# Altium schematic sheet raijel_sim_v1.SchDoc
size A2
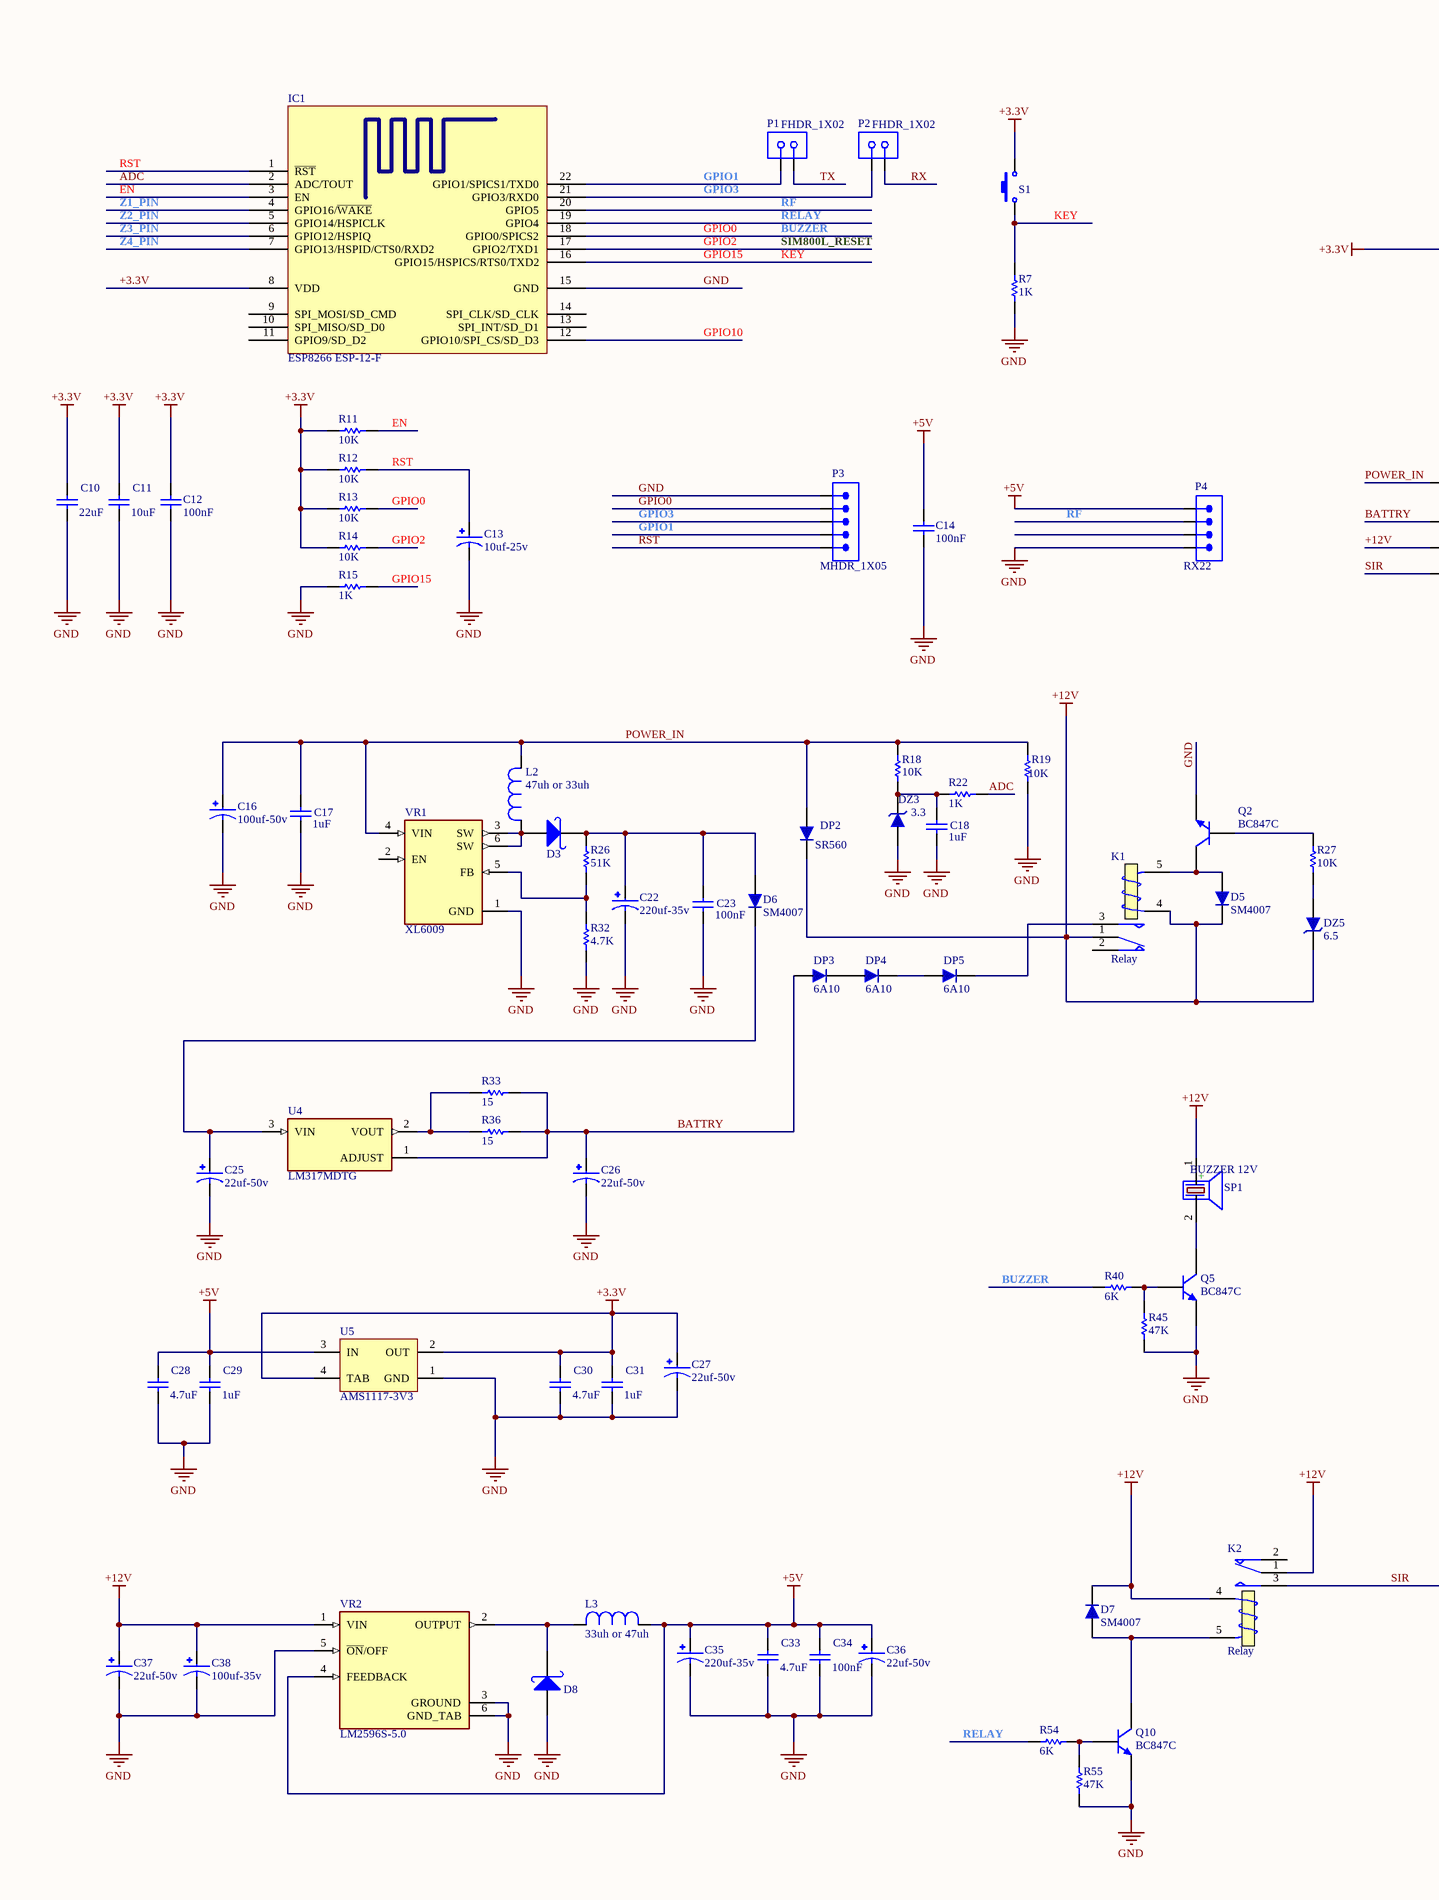
[diagram p0: raijel_sim_v1.SchDoc, left]
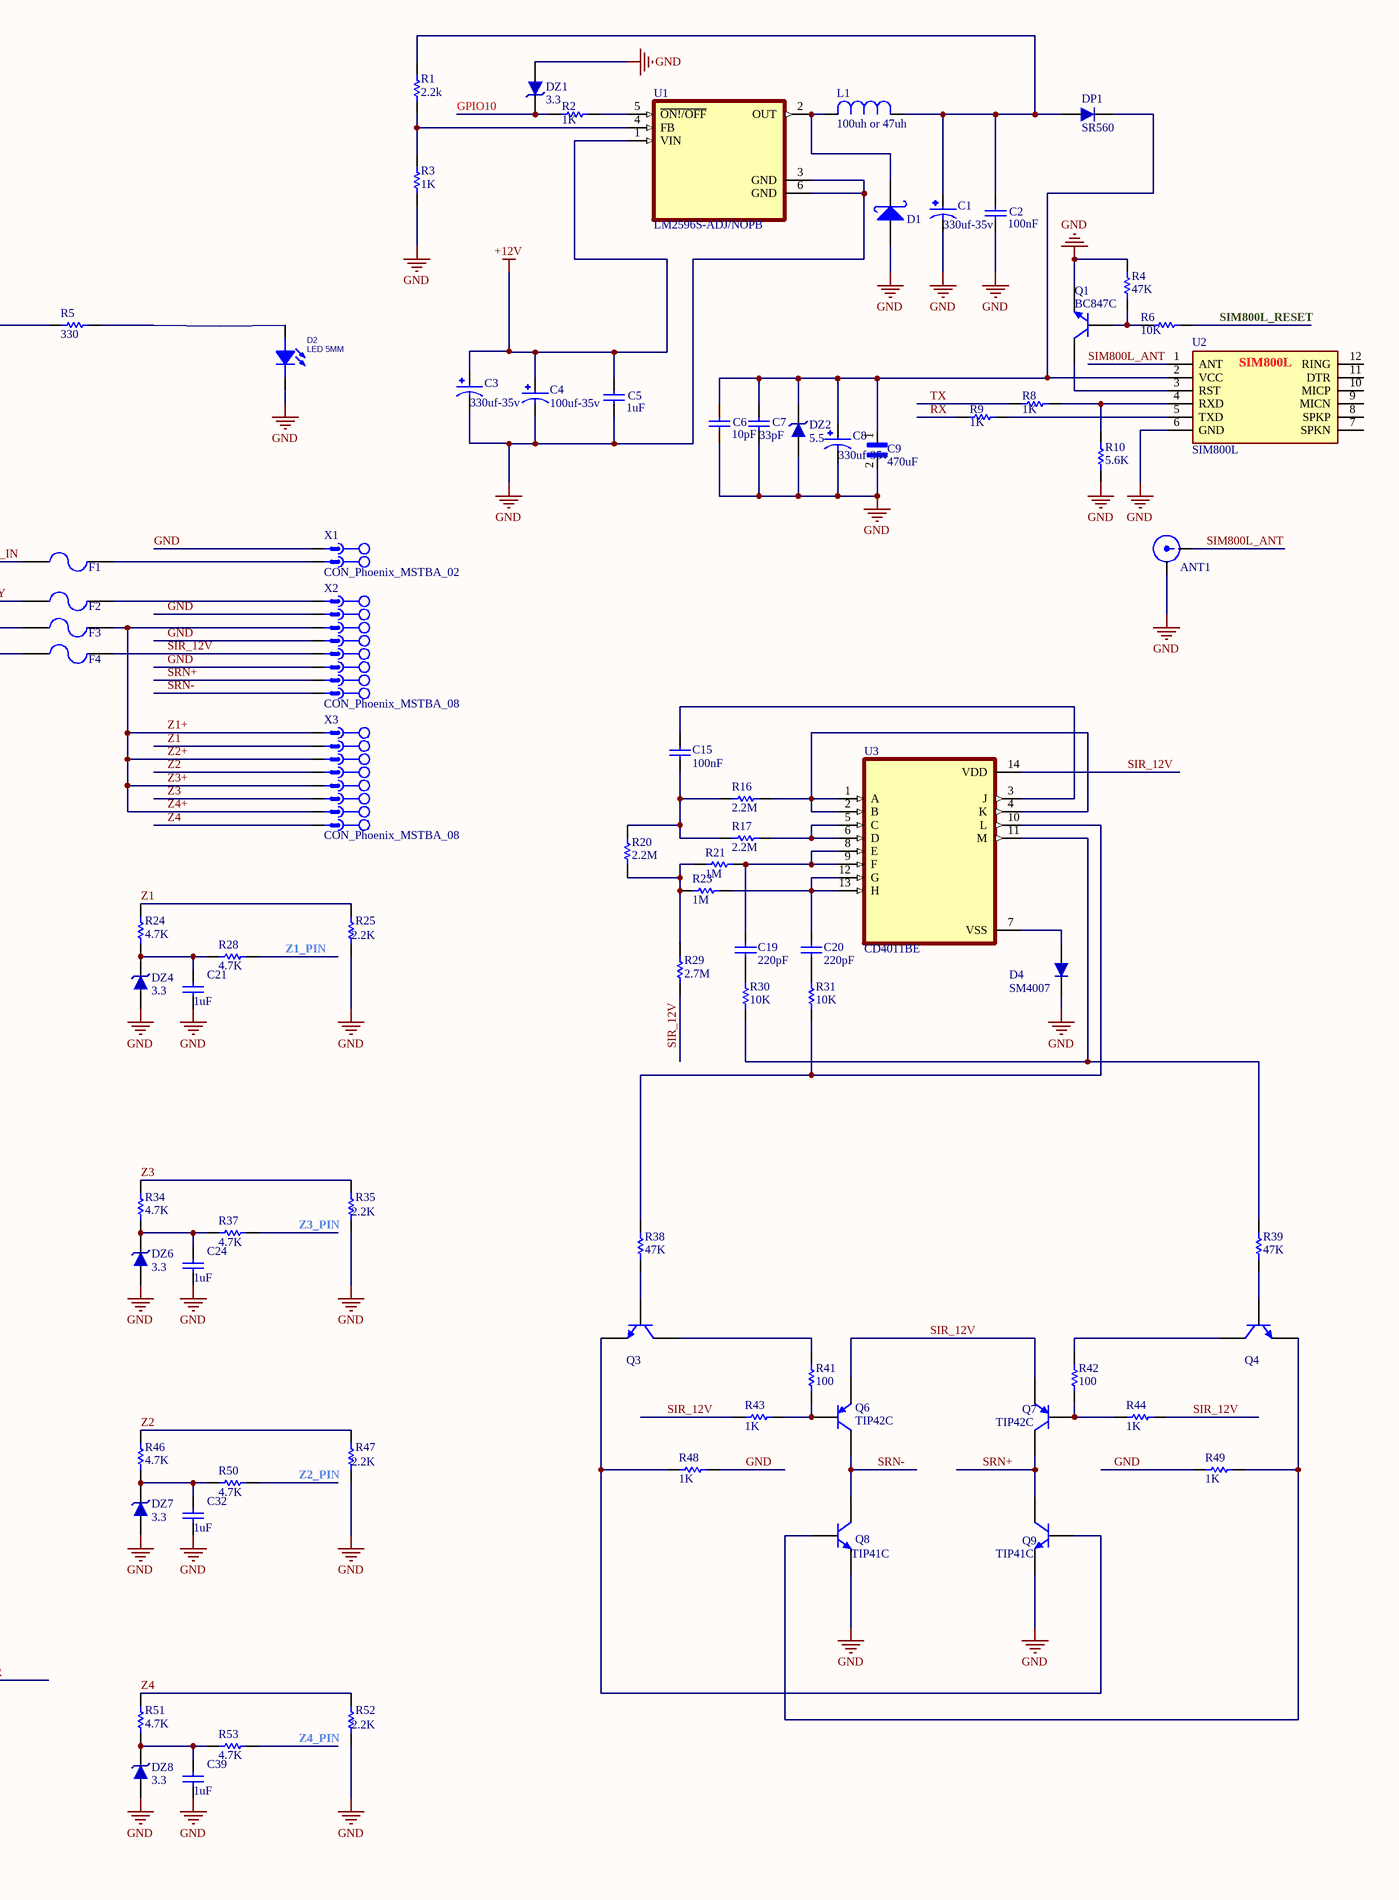
[diagram p1: raijel_sim_v1.SchDoc, right]

## Parts
ANT1  Antenna  [SMA]  (value not drawn)
C1  330uf-35v  [CAP_EEEFP1V221AV]
C2  100nF  [CAP0805]
C3  330uf-35v  [CAP_EEEFP1V221AV]
C4  100uf-35v  [CAP_EEEFP1V221AV]
C5  1uF  [CAP0805]
C6  10pF  [CAP0805]
C7  33pF  [CAP0805]
C8  330uf-35v  [CAP_EEEFP1V221AV]
C9  470uF  [CAPPM7343X310N]
C10  22uF  [CAP0805]
C11  10uF  [CAP0805]
C12  100nF  [CAP0805]
C13  10uf-25v  [CAP_EEEFN1H220UR]
C14  100nF  [CAP0805]
C15  100nF  [CAP Ceramic 5mm]
C16  100uf-50v  [CAP_EEEFN1H101L]
C17  1uF  [CAP0805]
C18  1uF  [CAP0805]
C19  220pF  [CAP Ceramic 5mm]
C20  220pF  [CAP Ceramic 5mm]
C21  1uF  [CAP0805]
C22  220uf-35v  [CAP_EEEFP1V221AV]
C23  100nF  [CAP0805]
C24  1uF  [CAP0805]
C25  22uf-50v  [CAP_EEEFN1H220UR]
C26  22uf-50v  [CAP_EEEFN1H220UR]
C27  22uf-50v  [CAP_EEEFN1H220UR]
C28  4.7uF  [CAP0805]
C29  1uF  [CAP0805]
C30  4.7uF  [CAP0805]
C31  1uF  [CAP0805]
C32  1uF  [CAP0805]
C33  4.7uF  [CAP0805]
C34  100nF  [CAP0805]
C35  220uf-35v  [CAP_EEEFP1V221AV]
C36  22uf-50v  [CAP_EEEFN1H220UR]
C37  22uf-50v  [CAP_EEEFN1H220UR]
C38  100uf-35v  [CAP_EEEFP1V221AV]
C39  1uF  [CAP0805]
D1  1n5822  [DO-214AB(SMC)]  (value not drawn)
D2  LED 5MM  [LED5MM_GRN]
D3  1n5822  [DO-214AB(SMC)]  (value not drawn)
D4  SM4007  [DIODE SMD]
D5  SM4007  [DIODE SMD]
D6  SM4007  [DIODE SMD]
D7  SM4007  [DIODE SMD]
D8  1n5822  [DO-214AB(SMC)]  (value not drawn)
DP1  SR560  [DO-201AD - vertical]
DP2  SR560  [DO-201AD - vertical]
DP3  6A10  [DO-201AD - vertical]
DP4  6A10  [DO-201AD - vertical]
DP5  6A10  [DO-201AD - vertical]
DZ1  3.3  [SOD80, LL-34]
DZ2  5.5  [SOD80, LL-34]
DZ3  3.3  [SOD80, LL-34]
DZ4  3.3  [SOD80, LL-34]
DZ5  6.5  [SOD80, LL-34]
DZ6  3.3  [SOD80, LL-34]
DZ7  3.3  [SOD80, LL-34]
DZ8  3.3  [SOD80, LL-34]
F1  F=1.0 A  [Fuse 5x20 With holder pin]  (value not drawn)
F2  F=1.0 A  [Fuse 5x20 With holder pin]  (value not drawn)
F3  F=1.0 A  [Fuse 5x20 With holder pin]  (value not drawn)
F4  F=1.0 A  [Fuse 5x20 With holder pin]  (value not drawn)
IC1  ESP8266 ESP-12-F  [ESP8266-12E]
K1  Relay  [Relay 15.40x12.10x13.10]
K2  Relay  [Relay 15.40x12.10x13.10]
L1  100uh or 47uh  [IND_CDRH127/LDNP-470MC_SUM]
L2  47uh or 33uh  [IND_CDRH127/LDNP-470MC_SUM]
L3  33uh or 47uh  [IND_CDRH127/LDNP-470MC_SUM]
P1  FHDR_1X02  [FHDR1X02-254P]
P2  FHDR_1X02  [FHDR1X02-254P]
P3  MHDR_1X05  [MHDR1X05-254P]
P4  RX22  [MHDR1X04-254P]
Q1  BC847C  [SOT23_N]
Q2  BC847C  [SOT23_N]
Q3  BC547  [TO-92 BENT]  (value not drawn)
Q4  BC547  [TO-92 BENT]  (value not drawn)
Q5  BC847C  [SOT23_N]
Q6  TIP42C  [TO-220 AB]
Q7  TIP42C  [TO-220 AB]
Q8  TIP41C  [TO-220 AB]
Q9  TIP41C  [TO-220 AB]
Q10  BC847C  [SOT23_N]
R1  2.2k  [RES0805]
R2  1K  [RES0805]
R3  1K  [RES0805_(2012X06L)]
R4  47K  [RES0805]
R5  330  [RES0805]
R6  10K  [RES0805]
R7  1K  [RES0805]
R8  1K  [RES0805]
R9  1K  [RES0805]
R10  5.6K  [RES0805]
R11  10K  [RES0805]
R12  10K  [RES0805]
R13  10K  [RES0805]
R14  10K  [RES0805]
R15  1K  [RES0805]
R16  2.2M  [RES0805]
R17  2.2M  [RES0805]
R18  10K  [RES0805]
R19  10K  [RES0805]
R20  2.2M  [RES0805]
R21  1M  [RES0805]
R22  1K  [RES0805]
R23  1M  [RES0805]
R24  4.7K  [RES1206]
R25  2.2K  [RES1206]
R26  51K  [RES0805_(2012X06L)]
R27  10K  [RES0805]
R28  4.7K  [RES0805]
R29  2.7M  [RES0805]
R30  10K  [RES0805]
R31  10K  [RES0805]
R32  4.7K  [RES0805_(2012X06L)]
R33  15  [Axial 0_5W 5_0mm]
R34  4.7K  [RES1206]
R35  2.2K  [RES1206]
R36  15  [Axial 0_5W 5_0mm]
R37  4.7K  [RES0805]
R38  47K  [RES0805]
R39  47K  [RES0805]
R40  6K  [RES0805]
R41  100  [Axial 0_5W 5_0mm]
R42  100  [Axial 0_5W 5_0mm]
R43  1K  [RES0805]
R44  1K  [RES0805]
R45  47K  [RES0805]
R46  4.7K  [RES1206]
R47  2.2K  [RES1206]
R48  1K  [RES0805]
R49  1K  [RES0805]
R50  4.7K  [RES0805]
R51  4.7K  [RES1206]
R52  2.2K  [RES1206]
R53  4.7K  [RES0805]
R54  6K  [RES0805]
R55  47K  [RES0805]
S1  Switch PB  [Switch - Push to On]  (value not drawn)
SP1  BUZZER 12V  [BUZZER 7.62mm DC]
U1  LM2596S-ADJ/NOPB  [VREG_LM2596S-ADJ/NOPB]
U2  SIM800L  [SIM800L]
U3  CD4011BE  [DIP794W45P254L1969H508Q14]
U4  LM317MDTG  [VREG_LM317MDTG]
U5  AMS1117-3V3  [SOT223]
VR1  XL6009  [DPAK170P1435X465-6N]
VR2  LM2596S-5.0  [TO170P1524X483-6N]
X1  CON_Phoenix_MSTBA_02  [CON_MSTBA02]
X2  CON_Phoenix_MSTBA_08  [CON_MSTBA08]
X3  CON_Phoenix_MSTBA_08  [CON_MSTBA08]

## Nets
+3.3V: C10.2 C11.2 C12.2 C27.1 C30.2 C31.2 IC1.8(VDD) R5.1 R11.2 R12.2 R13.2 R14.2 S1.2 U5.2(OUT) U5.4(TAB)
+5V: C14.2 C28.2 C29.2 C33.2 C34.2 C35.1 C36.1 L3.1 P4.1 U5.3(IN) VR2.4(FEEDBACK)
+12V: C3.1 C4.1 C5.2 C37.1 C38.1 D5.2 D7.2 DP2.2 DZ5.2 F3.1 K1.1(COM) K1.4(T1) K2.1(COM) K2.4(T1) SP1.1(+) U1.1(VIN) VR2.1(VIN)
GND: ANT1.2 C1.2 C2.1 C3.2 C4.2 C5.1 C6.1 C7.1 C8.2 C9.2 C10.1 C11.1 C12.1 C13.2 C14.1 C16.2 C17.1 C18.1 C21.1 C22.2 C23.1 C24.1 C25.2 C26.2 C27.2 C28.1 C29.1 C30.1 C31.1 C32.1 C33.1 C34.1 C35.2 C36.2 C37.2 C38.2 C39.1 D1.1(A) D2.2(CATHODE) D4.2 D8.1(A) DZ1.1 DZ2.1 DZ3.1 DZ4.1 DZ6.1 DZ7.1 DZ8.1 IC1.15(GND) P3.1 P4.4 Q1.2(E) Q2.2(E) Q5.2(E) Q8.3(E) Q9.3(E) Q10.2(E) R3.1 R4.2 R7.2 R10.2 R15.2 R19.2 R25.2 R32.1 R35.2 R45.1 R47.2 R48.1 R49.2 R52.2 R55.1 U1.3(GND) U1.6(GND) U2.6(GND) U5.1(GND) VR1.1(GND) VR2.3(GROUND) VR2.5(~{ON}/OFF) VR2.6(GND_TAB) X1.1 X2.2 X2.4 X2.6
ADC: IC1.2(ADC/TOUT) R22.1
BATTRY: C26.1 DP3.1 F2.1 R33.2 R36.2 U4.1(ADJUST)
BUZZER: IC1.18(GPIO0/SPICS2) P3.2 R13.1 R40.2  [also labelled GPIO0]
EN: IC1.3(EN) R11.1
GPIO1: IC1.22(GPIO1/SPICS1/TXD0) P1.1 P3.4
GPIO2: IC1.17(GPIO2/TXD1) R6.2 R14.1  [also labelled SIM800L_RESET]
GPIO3: IC1.21(GPIO3/RXD0) P2.1 P3.3
GPIO10: DZ1.2 IC1.12(GPIO10/SPI_CS/SD_D3) R2.1
GPIO15: IC1.16(GPIO15/HSPICS/RTS0/TXD2) R7.1 R15.1 S1.1  [also labelled KEY]
POWER_IN: C16.1 C17.2 DP2.1 F1.1 L2.1 R18.2 R19.1 VR1.4(VIN)
RELAY: IC1.19(GPIO4) R54.2
RF: IC1.20(GPIO5) P4.2
RST: C13.1 IC1.1(~{RST}) P3.5 R12.1
RX: P2.2 R9.1
SIM800L_ANT: ANT1.1 U2.1(ANT)
SIR: F4.1 K2.3(NO)
SIR_12V: F4.2 Q6.3(E) Q7.3(E) R29.1 R43.2 R44.1 U3.14(VDD) X2.5
SRN+: Q7.2(C) Q9.2(C) X2.7
SRN-: Q6.2(C) Q8.2(C) X2.8
TX: P1.2 R8.1
Z1: R24.2 R25.1 X3.2
Z1+: F3.2 X2.3 X3.1 X3.3 X3.5 X3.7  [also labelled Z2+, Z3+, Z4+]
Z1_PIN: IC1.4(GPIO16/~{WAKE}) R28.1
Z2: R46.2 R47.1 X3.4
Z2_PIN: IC1.5(GPIO14/HSPICLK) R50.1
Z3: R34.2 R35.1 X3.6
Z3_PIN: IC1.6(GPIO12/HSPIQ) R37.1
Z4: R51.2 R52.1 X3.8
Z4_PIN: IC1.7(GPIO13/HSPID/CTS0/RXD2) R53.1
NetC1_1: C1.1 C2.2 DP1.1 L1.1 R1.1
NetC6_2: C6.2 C7.2 C8.1 C9.1 DP1.2 DZ2.2 U2.2(VCC)
NetC15_1: C15.1 U3.3(J)
NetC15_2: C15.2 R16.2 R17.2 R20.1
NetC18_2: C18.2 DZ3.2 R18.1 R22.2
NetC19_1: C19.1 R21.2 U3.8(E) U3.9(F)
NetC19_2: C19.2 R30.1
NetC20_1: C20.1 R23.2 U3.12(G) U3.13(H)
NetC20_2: C20.2 R31.1
NetC21_2: C21.2 DZ4.2 R24.1 R28.2
NetC22_1: C22.1 C23.2 D3.2(K) D6.1 R26.2
NetC24_2: C24.2 DZ6.2 R34.1 R37.2
NetC25_1: C25.1 D6.2 U4.3(VIN)
NetC32_2: C32.2 DZ7.2 R46.1 R50.2
NetC39_2: C39.2 DZ8.2 R51.1 R53.2
NetD1_2: D1.2(K) L1.2 U1.2(OUT)
NetD2_1: D2.1(ANODE) R5.2
NetD3_1: D3.1(A) L2.2 VR1.3(SW) VR1.6(SW)
NetD4_1: D4.1 U3.7(VSS)
NetD5_1: D5.1 K1.5(T2) Q2.3(C)
NetD7_1: D7.1 K2.5(T2) Q10.3(C)
NetD8_2: D8.2(K) L3.2 VR2.2(OUTPUT)
NetDP3_2: DP3.2 DP4.1
NetDP4_2: DP4.2 DP5.1
NetDP5_2: DP5.2 K1.3(NO)
NetDZ5_1: DZ5.1 R27.2
NetF1_2: F1.2 X1.2
NetF2_2: F2.2 X2.1
NetQ1_1: Q1.1(B) R4.1 R6.1
NetQ1_3: Q1.3(C) U2.3(RST)
NetQ2_1: Q2.1(B) R27.1
NetQ3_1: Q3.1(C) R41.2
NetQ3_2: Q3.2(B) R38.2
NetQ3_3: Q3.3(E) Q9.1(B) R48.2
NetQ4_1: Q4.1(C) R42.2
NetQ4_2: Q4.2(B) R39.2
NetQ4_3: Q4.3(E) Q8.1(B) R49.1
NetQ5_1: Q5.1(B) R40.1 R45.2
NetQ5_3: Q5.3(C) SP1.2(-)
NetQ6_1: Q6.1(B) R41.1 R43.1
NetQ7_1: Q7.1(B) R42.1 R44.2
NetQ10_1: Q10.1(B) R54.1 R55.2
NetR1_2: R1.2 R3.2 U1.4(FB)
NetR2_2: R2.2 U1.5(~{ON!/OFF})
NetR8_2: R8.2 R10.1 U2.4(RXD)
NetR9_2: R9.2 U2.5(TXD)
NetR16_1: R16.1 U3.1(A) U3.2(B) U3.4(K)
NetR17_1: R17.1 U3.5(C) U3.6(D)
NetR20_2: R20.2 R21.1 R23.1 R29.2
NetR26_1: R26.1 R32.2 VR1.5(FB)
NetR30_2: R30.2 R39.1 U3.11(M)
NetR31_2: R31.2 R38.1 U3.10(L)
NetR33_1: R33.1 R36.1 U4.2(VOUT)

Not connected (* = marked no-connect by the designer): IC1 9(SPI_MOSI/SD_CMD) 10(SPI_MISO/SD_D0) 11(GPIO9/SD_D2) 13(SPI_INT/SD_D1) 14(SPI_CLK/SD_CLK); K1 2(NC); K2 2(NC); P4 3; U2 7(SPKN) 8(SPKP) 9(MICN) 10(MICP) 11(DTR) 12(RING); VR1 2(EN)

## Library data of the parts
ANT1 = ANT SMA: Designer: Ali Hafizi
C1 C3 C4 C8 C22 C35 C38 = EEEFP1V221AV: CAP ALUM 220UF 20% 35V SMD; MF: Panasonic Electronic Components; MP: EEE-FP1V221AV; SnapEDA_Link: https://www.snapeda.com/parts/EEE-FP1V221AV/Panasonic/view-part/4900934/?ref=snap; Price: None; Availability: Not in stock; Value: *; Check_prices: https://www.snapeda.com/parts/EEE-FP1V221AV/Panasonic/view-part/4900934/?ref=eda; Package: RADIAL-2 Panasonic
C2 C12 C14 C23 C34 = CAP SMD PACKAGE: TOTAL CAPACITOR SMD PACK; Designer: Abbas Basereh; Desc.: CAP SMD TOTAL PACKAGES; Data: 2017-3-10; VALUE: 100nF
C5-C7 C10 C11 C17 C18 C21 C24 C28-C33 C39 = CAP SMD PACKAGE: TOTAL CAPACITOR SMD PACK; Designer: Abbas Basereh; Desc.: CAP SMD TOTAL PACKAGES; VALUE: 100nF; Data: 2017-3-10
C9 = TAJD476K025RNJ: TC 47uF 25V 10% Case D; Package: None; Price: None; Value: *; MP: TAJD476K025RNJ; Availability: Unavailable
C13 C25-C27 C36 C37 = EEEFN1H220UR: CAP ALUM 22UF 20% 50V SMD; MF: Panasonic Electronic Components; MP: EEE-FN1H220UR; Value: *; SnapEDA_Link: https://www.snapeda.com/parts/EEE-FN1H220UR/Panasonic/view-part/6178088/?ref=snap; Check_prices: https://www.snapeda.com/parts/EEE-FN1H220UR/Panasonic/view-part/6178088/?ref=eda; Purchase-URL: https://pricing.snapeda.com/search/part/EEE-FN1H220UR/?ref=eda; Price: None; Availability: In Stock; Package: RADIAL-2 Panasonic
C15 C19 C20 = CAP CERAMIC TOTAL SIZE: CAP Ceramic Total; Designer: Ali Hafizi
C16 = EEEFN1H101L: CAP ALUM 100UF 20% 50V SMD; MP: EEE-FN1H101L; MF: Panasonic Electronic Components; Value: *; SnapEDA_Link: https://www.snapeda.com/parts/EEE-FN1H101L/Panasonic/view-part/6178263/?ref=snap; Availability: In Stock; Package: RADIAL-2 Panasonic; Purchase-URL: https://pricing.snapeda.com/search/part/EEE-FN1H101L/?ref=eda; Price: None; Check_prices: https://www.snapeda.com/parts/EEE-FN1H101L/Panasonic/view-part/6178263/?ref=eda
D1 D3 D8 = 1N5822 SMD: Schottky Rectifiers; Part. No: SS34; Manufacturer: ON Semiconductor/Fairchild; Designer: Abbas Basereh; Link: https://www.aliexpress.com/item/Free-shipping-100pcs-1n5822-sma-smd-do-214ac-Schottky-diode-ss34/32337482329.html?spm=2114.01010208.3.1.zLZDsP&ws_ab_test=searchweb0_0,searchweb201602_4_10065_10068_10084_10083_10080_10082_10081_10060_10061_10062_10056_10055_10054_10059_10099_10078_10079_427_10073_10103_10102_10096_10052_10050_10051,searchweb201603_4&btsid=6e50dc92-ac69-45bc-a19e-209af19ce602; Link: http://www.tme.eu/en/details/ss34/smd-schottky-diodes/vishay/ss34-e357t/; Link: http://www.digikey.com/product-detail/en/on-semiconductor-fairchild/SS34/SS34FSCT-ND/2094459; Data: 16-12-2016
D2 = LED 5MM: Light Emitting Diode; Designer: Abbas Basereh; Data: 16-12-2016; Link: *; Part.No: *
D4-D7 = Diode SMD Package: Diode SMD Pakage
DP1-DP5 = 1N5408 3A 1000V: General Semiconductor. Revision 3A 1000V Silicon Rectifier; Part. No: 1N5408; Designer: Abbas Basereh; Data: 16-12-2016; Link: *
DZ1-DZ8 = ZENER GENERAL DIODE: DIODE ZENER GENERAL; VALUE: 12V; Published: 2017-1-12; PackageVersion: 2017-1-12; PackageReference: DO 35; Publisher: Abbas Basereh; PackageDescription: DIODE GEN ZENER; ComponentLink1Description: Manufacturer Link; ComponentLink2Description: Datasheet
F1-F4 = Fuse 5x20 with holdeer pins: Fuses 5x20; Designer: Abbas Basereh; Desc.: fuse with holder pins 5x20; Data: 28-12-2016
IC1 = ESP8266 ESP-12-E
K1 K2 = RELAY General: Relay_SPDT POWER NEEDLE; Designer: Ali Hafizi; Company: E.P.I.L; Design_Date: 2011/10/31
L1-L3 = CDRH127/LDNP-470MC: 47ÂµH Shielded Inductor 3.25A 78mOhm Max Nonstandard; MF: Sumida America; Digi-Key_Part_Number: 308-1339-1-ND; Check_prices: https://www.snapeda.com/parts/CDRH127/LDNP-470MC/Sumida%20America%20Components%20Inc./view-part/547921/?ref=eda; Package: Nonstandard Sumida; Value: *; MP: CDRH127/LDNP-470MC; SnapEDA_Link: https://www.snapeda.com/parts/CDRH127/LDNP-470MC/Sumida%20America%20Components%20Inc./view-part/547921/?ref=snap; Purchase-URL: https://pricing.snapeda.com/search/part/CDRH127/LDNP-470MC/?ref=eda
P1 P2 = FHDR_1X02: Female Header 1X02
P3 = MHDR_1X05: Male Header 1X05
P4 = MHDR_1X04: Male Header 1X04
Q1 Q2 Q5 Q10 = BC847C: NPN General-purpose Transistor; Published: 2017-1-6; LatestRevisionDate: 12-Dec-2006; LatestRevisionNote: IPC-7351 Footprint Added.; DatasheetVersion: 4-Feb-2002; PackageVersion: 2017-1-6; PackageReference: SOT23; Publisher: Abbas Basereh; PackageDescription: 3-Pin SOT-23 Package 0.95 mm Pitch, 2.3 mm Lead Span; ComponentLink1Description: Manufacturer Link; ComponentLink1URL: http://www.semiconductors.philips.com/; ComponentLink2Description: Datasheet; ComponentLink2URL: http://www.semiconductors.philips.com/acrobat/datasheets/BC846_BC847_BC848_5.pdf
Q3 Q4 = BC547: NPN General-purpose Transistor; Designer: Abbas Basereh; Desc.: Plastic Medium-Power. Silicon NPN Transistors; Data: 27-12-2016
Q6 Q7 = TIP42C: PNP  power transistor; Manufacturer: STMicroelectronics; Designer: Abbas Basereh; DESC.: Complementary power transistors; Link: https://www.aliexpress.com/item/; Link: http://www.tme.eu/en/; Link: http://www.digikey.com/; Part. No: TIP42C
Q8 Q9 = TIP41C: NPN  power transistor; Manufacturer: STMicroelectronics; Designer: Abbas Basereh; DESC.: Complementary power transistors; Link: https://www.aliexpress.com/item/; Link: http://www.tme.eu/en/; Link: http://www.digikey.com/; Part. No: TIP41C
R1-R32 R34 R35 R37-R40 R43-R55 = RES SMD PACKAGE: TOTAL SMD RESISTOR PACK; Designer: Abbas Basereh; Desc.: RES SMD PAKAGES; Data: 2017-3-10
R33 R36 R41 R42 = RES Axial 0.5W: Designer: Abbas Basereh; Desc.: RES Axial 0.5W; Data: 4-1-2017
S1 = Switch PB: Push Button Switch
SP1 = PIEZO BUZZER: PIEZO BUZZER ACTIVE; Designer: Abbas Basereh; Comment_1: SPEAKER AND BEEP; Design Date: 1395/11/14; ComponentLink2Description: Reference; PackageDescription: THD; Publisher: Abbas Basereh; Mounting Technology: THD; Pin Count: 2; Status: Unreleased
U1 = LM2596S-ADJ/NOPB: SIMPLE SWITCHER&reg; 4.5V to 40V, 3A Low Component Count Step-Down Regulator 5-DDPAK/TO-263 -40 to 125; MF: Texas Instruments; MP: LM2596S-ADJ/NOPB; Price: None; Availability: Unavailable; SnapEDA_Link: https://www.snapeda.com/parts/LM2596S-ADJ/NOPB/Texas%20Instruments/view-part/276908/?ref=snap; Texas_Instruments-Purchase-URL: https://snapeda.com/shop?store=Texas+Instruments&id=276908; Value: *; Mouser-Purchase-URL: https://snapeda.com/shop?store=Mouser&id=276908; Package: TO-263-5 Texas Instruments; DigiKey-Purchase-URL: https://snapeda.com/shop?store=DigiKey&id=276908
U4 = LM317MDTG: Linear Voltage Regulator IC Positive Adjustable 1 Output 500mA DPAK; MF: ON Semiconductor; SnapEDA_Link: https://www.snapeda.com/parts/LM317MDTG/Onsemi/view-part/?ref=snap; MP: LM317MDTG; Purchase-URL: https://pricing.snapeda.com/search/part/LM317MDTG/?ref=eda; Value: *; Digi-Key_Part_Number: LM317MDTGOS-ND; Check_prices: https://www.snapeda.com/parts/LM317MDTG/Onsemi/view-part/?ref=eda; Package: DPAK-3 ON Semiconductor
U5 = AMS1117-x.x: x.x Volt, 800mA Low-Dropout Linear Regulator, 4-pin SOT-223; Designer: Ali Hafizi; Data: 16-12-2016
VR1 = XL6009: The XL6009 regulator is a wide input range, current mode, DC/DC converter which is capable of generating either positive or negative output voltages.; Package: None; Availability: Unavailable; Value: *; MP: XL6009; Price: None
X1 = CON_Phoenix_MSTBA_02: Manufacturer: PHOENIX CONTACT; Company: SJ Libraries; Connector type: PCB Terminal Block; designer: Eng. Saeid Jorablo; Max Current: 12 A; Positions: 2; Revision 1: 2012/10/1 : Adding Model; Voltage: 320 V; Category: Connector; ComponentLink1Description: Datasheet; ComponentLink2Description: Reference; HelpURL: http://s3.picofile.com/file/7443264187/Coming_Soon_logo.gif; Mounting Technology: Through-Hole; Pin Count: 2; Publisher: SJ UnLimited; Status: Unreleased; Update: 2012/10/1
X2 X3 = CON_Phoenix_MSTBA_08: Manufacturer: PHOENIX CONTACT; Company: SJ Libraries; Connector type: PCB Terminal Block; designer: Eng. Saeid Jorablo; Max Current: 12 A; Positions: 8; Revision 1: 2012/10/1 : Adding Model; Voltage: 320 V; Category: Connector; ComponentLink1Description: Datasheet; ComponentLink2Description: Reference; HelpURL: http://s3.picofile.com/file/7443264187/Coming_Soon_logo.gif; Mounting Technology: Through-Hole; Pin Count: 8; Publisher: SJ UnLimited; Status: Unreleased; Update: 2012/10/1
U2 = SIM800L: Publisher: 3DFootprint.ir
U3 = CD4011BE: Package: None; MP: CD4011BE; Value: *; Availability: Unavailable; Price: None
VR2 = LM2596S-5.0: Value: *; MP: LM2596S-5.0; Package: None; Availability: Unavailable; Price: None